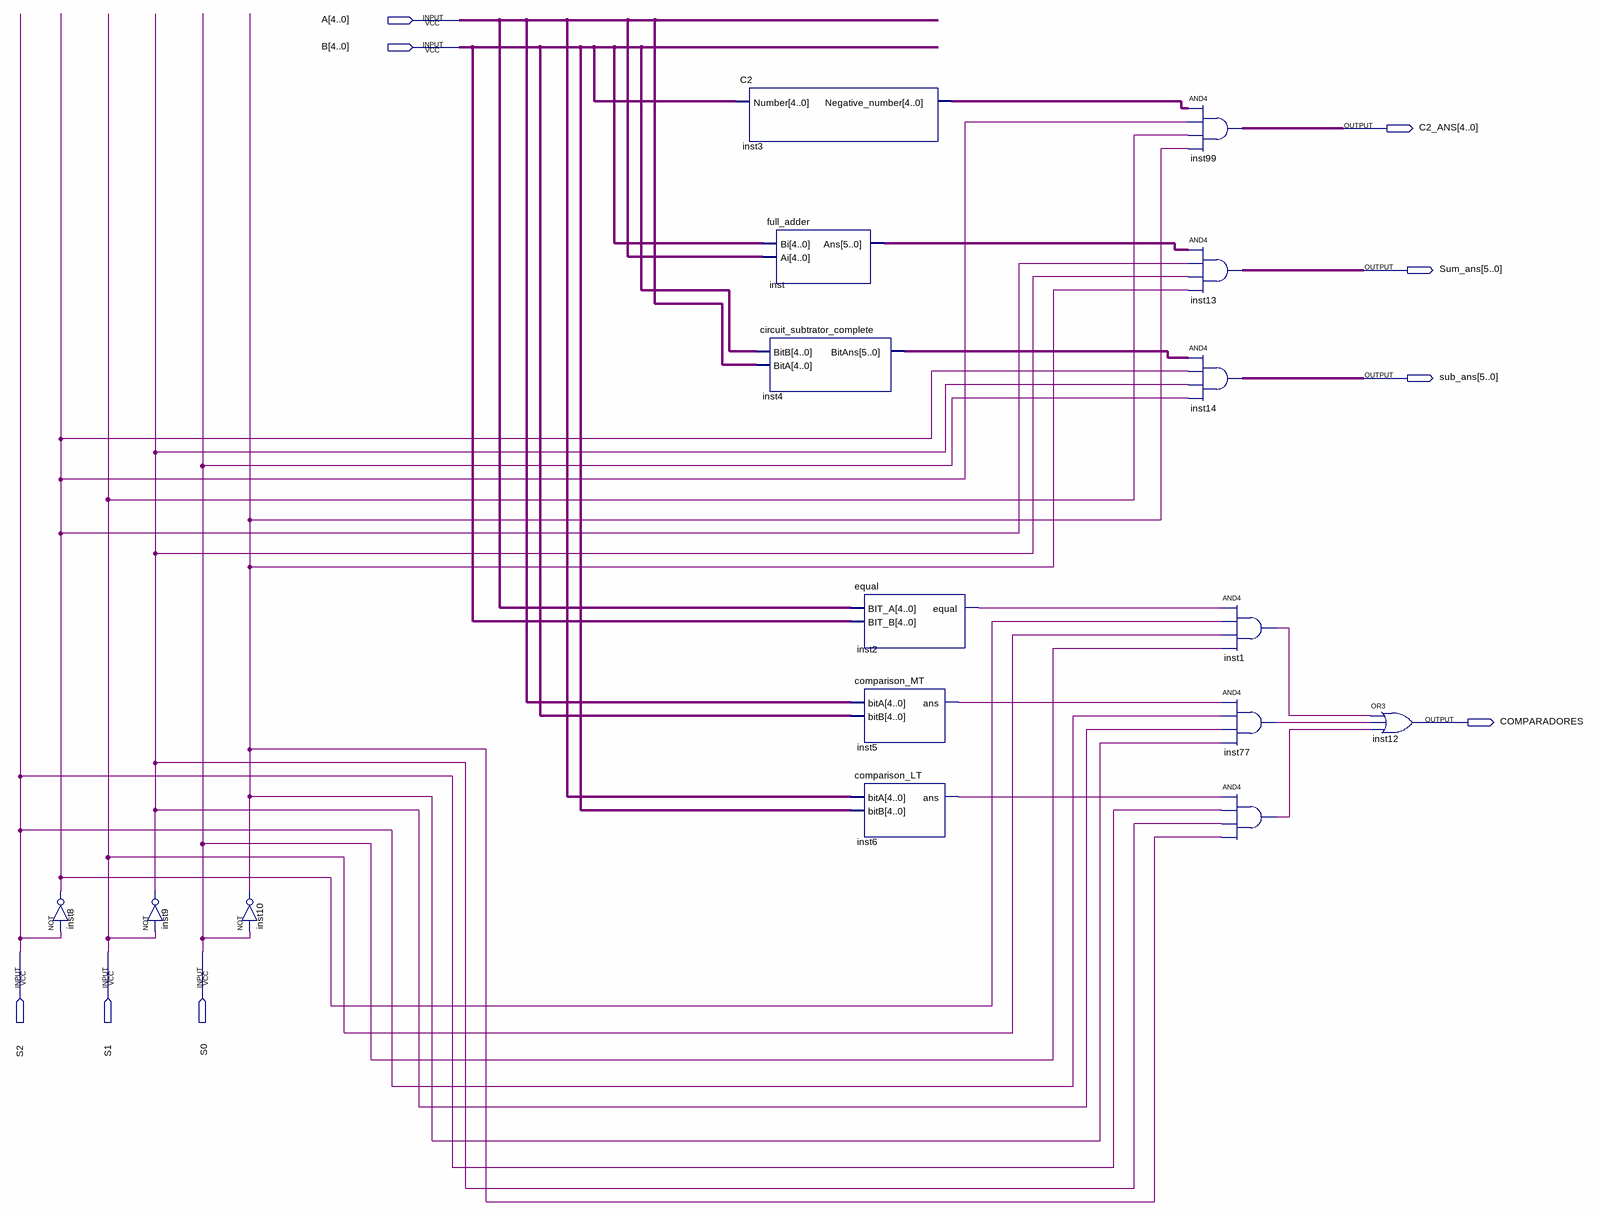
[diagram p0: schematic sheet]
// Quartus schematic ULA.bdf as structural Verilog: 16 symbols, 9 pins
module ULA (
  input  [4:0] A,
  input  [4:0] B,
  input  S2,
  input  S1,
  input  S0,
  output [4:0] C2_ANS,
  output [5:0] Sum_ans,
  output [5:0] sub_ans,
  output COMPARADORES
);

  wire _out, inst1_out, inst2_equal, inst5_ans, inst6_ans, inst8_out, inst9_out, inst10_out, inst77_out;
  wire [4:0] inst3_negative_number;
  wire [5:0] inst4_bitans, inst_ans;

  not inst8 (inst8_out, S2);
  not inst9 (inst9_out, S1);
  not inst10 (inst10_out, S0);
  C2 inst3 (.Number(B), .Negative_number(inst3_negative_number));
  full_adder inst (.Bi(B), .Ai(A), .Ans(inst_ans));
  circuit_subtrator_complete inst4 (.BitB(B), .BitA(A), .BitAns(inst4_bitans));
  equal inst2 (.BIT_A(A), .BIT_B(B), .equal(inst2_equal));
  comparison_MT inst5 (.bitA(A), .bitB(B), .ans(inst5_ans));
  comparison_LT inst6 (.bitA(A), .bitB(B), .ans(inst6_ans));
  assign C2_ANS = inst3_negative_number & {5{inst8_out}} & {5{S1}} & {5{inst10_out}};  // AND4 inst99, 5 bits wide
  assign Sum_ans = inst_ans & {6{inst8_out}} & {6{inst9_out}} & {6{inst10_out}};  // AND4 inst13, 6 bits wide
  assign sub_ans = inst4_bitans & {6{inst8_out}} & {6{inst9_out}} & {6{S0}};  // AND4 inst14, 6 bits wide
  and inst1 (inst1_out, inst2_equal, inst8_out, S1, S0);
  and inst77 (inst77_out, inst5_ans, S2, inst9_out, inst10_out);
  and inst_dup2 (_out, inst6_ans, S2, inst9_out, inst10_out);
  or inst12 (COMPARADORES, inst1_out, inst77_out, _out);
endmodule
